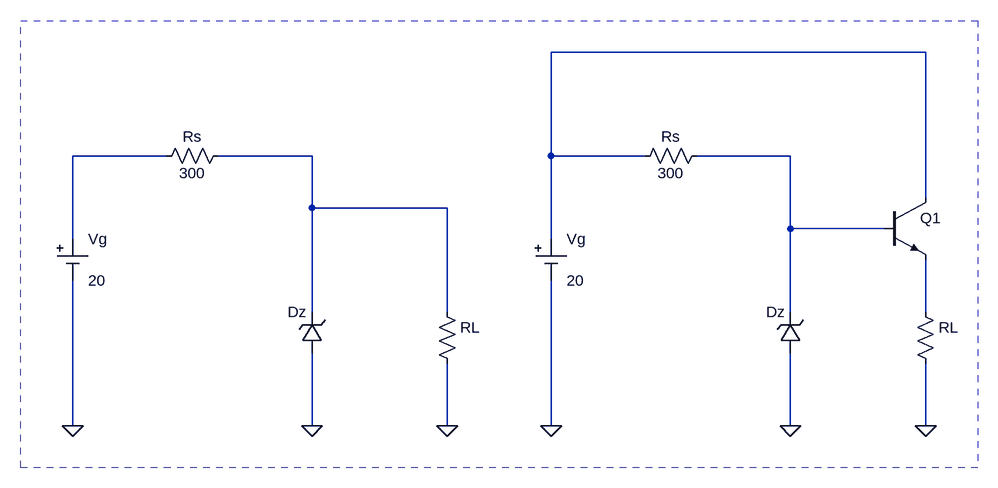
[diagram p0: schematic ej2-1.asc]
ej2-1.asc, the LTspice schematic file:
Version 4
SHEET 1 7772 18116
WIRE 1392 48 816 48
WIRE 224 208 80 208
WIRE 448 208 304 208
WIRE 816 208 816 48
WIRE 960 208 816 208
WIRE 1184 208 1040 208
WIRE 1392 272 1392 48
WIRE 448 288 448 208
WIRE 656 288 448 288
WIRE 1184 320 1184 208
WIRE 1328 320 1184 320
WIRE 80 336 80 208
WIRE 816 336 816 208
WIRE 448 448 448 288
WIRE 656 448 656 288
WIRE 1184 448 1184 320
WIRE 1392 448 1392 368
WIRE 80 624 80 400
WIRE 448 624 448 512
WIRE 656 624 656 528
WIRE 816 624 816 400
WIRE 1184 624 1184 512
WIRE 1392 624 1392 528
FLAG 1184 624 0
FLAG 816 624 0
FLAG 1392 624 0
FLAG 448 624 0
FLAG 80 624 0
FLAG 656 624 0
SYMBOL zener 1200 512 R180
WINDOW 0 24 64 Left 2
WINDOW 3 24 0 Invisible 2
SYMATTR InstName Dz
SYMBOL npn 1328 272 R0
WINDOW 3 56 68 Invisible 2
SYMATTR InstName Q1
SYMBOL res 1056 192 R90
WINDOW 0 2 56 VBottom 2
WINDOW 3 27 56 VTop 2
SYMATTR InstName Rs
SYMATTR Value 300
SYMBOL res 1376 432 R0
WINDOW 3 36 76 Invisible 2
SYMATTR InstName RL
SYMBOL zener 464 512 R180
WINDOW 0 24 64 Left 2
WINDOW 3 24 0 Invisible 2
SYMATTR InstName Dz
SYMBOL res 320 192 R90
WINDOW 0 2 56 VBottom 2
WINDOW 3 27 56 VTop 2
SYMATTR InstName Rs
SYMATTR Value 300
SYMBOL res 640 432 R0
WINDOW 3 36 76 Invisible 2
SYMATTR InstName RL
SYMBOL Misc\\cell 80 336 R0
WINDOW 123 0 0 Left 0
WINDOW 39 0 0 Left 0
SYMATTR InstName Vg
SYMATTR Value 20
SYMBOL Misc\\cell 816 336 R0
WINDOW 123 0 0 Left 0
WINDOW 39 0 0 Left 0
SYMATTR InstName Vg
SYMATTR Value 20
RECTANGLE Normal 1472 688 0 0 2

The netlist it stands for:
* ej2-1.asc
Dz 0 N004 D
Q1 N001 N004 N005 0 NPN
Rs N004 N001 300
RL N005 0 R
Dz 0 N003 D
Rs N003 N002 300
RL N003 0 R
Vg N002 0 20
Vg N001 0 20
.model D D
.lib standard.dio
.model NPN NPN
.model PNP PNP
.lib standard.bjt
.backanno
.end